# EAGLE schematic sterownik (EAGLE 8.4.0)
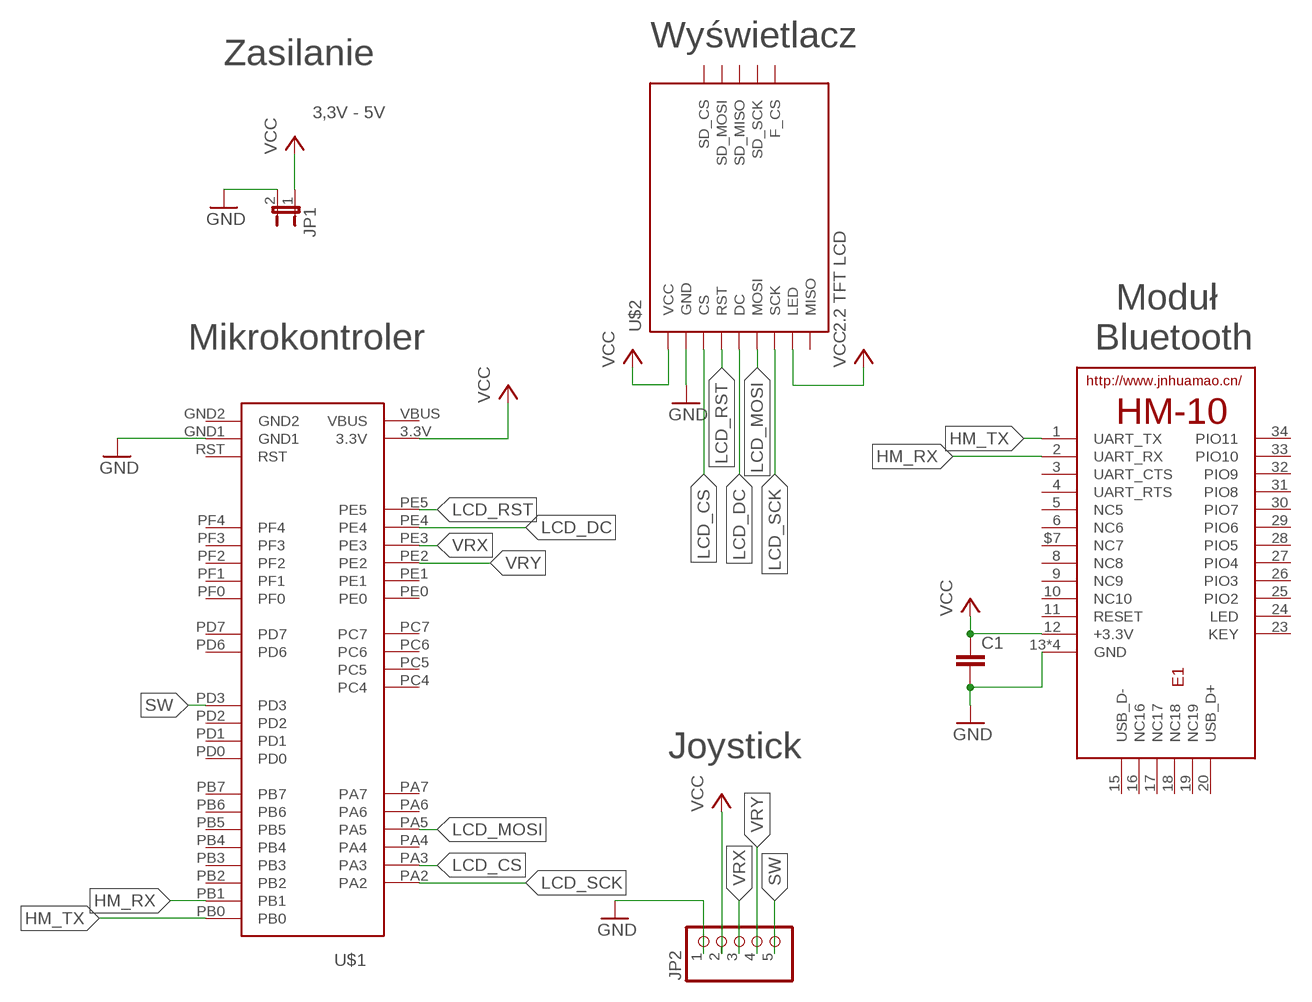
[diagram p0: schematic, sheet 1]

## Parts
C1  C-EU025-024X044  [C025-024X044]
E1  HM-10-BOARD  [26.9X13X2.2_BOARD]
JP1  JP1E  [JP1]
JP2  PINHD-1X55X2MM  [1_05X2MM]
U$1  STELLARIS-LAUNCHPADSTELLARIS-LAUNCHPAD  [LAUNCHPAD-XL]
U$2  2.2_TFT_LCD  [2.2_TFT_LCD]

## Nets
GND: C1.2 E1.13(GND) E1.14(GND) E1.21(GND) E1.22(GND) JP1.2 JP2.1 U$1.GND1 U$2.GND
HM_RX: E1.2(UART_RX) U$1.PB1
HM_TX: E1.1(UART_TX) U$1.PB0
LCD_CS: U$1.PA3 U$2.CS
LCD_DC: U$1.PE4 U$2.DC
LCD_MOSI: U$1.PA5 U$2.MOSI
LCD_RST: U$1.PE5 U$2.RST
LCD_SCK: U$1.PA2 U$2.SCK
SW: JP2.5 U$1.PD3
VCC: C1.1 E1.12(+3.3V) JP1.1 JP2.2 U$1.3.3V U$2.LED U$2.VCC
VRX: JP2.3 U$1.PE3
VRY: JP2.4 U$1.PE2
Unconnected: E1.3(UART_CTS) E1.4(UART_RTS) E1.5(NC5) E1.6(NC6) E1.8(NC8) E1.9(NC9) E1.10(NC10) E1.11(RESET) E1.15(USB_D-) E1.16(NC16) E1.17(NC17) E1.18(NC18) E1.19(NC19) E1.20(USB_D+) E1.23(KEY) E1.24(LED) E1.25(PIO2) E1.26(PIO3) E1.27(PIO4) E1.28(PIO5) E1.29(PIO6) E1.30(PIO7) E1.31(PIO8) E1.32(PIO9) E1.33(PIO10) E1.34(PIO11) E1.$7(NC7) U$1.PA4 U$1.PA6 U$1.PA7 U$1.PB2 U$1.PB3 U$1.PB4 U$1.PB5 U$1.PB6 U$1.PB7 U$1.PC4 U$1.PC5 U$1.PC6 U$1.PC7 U$1.PD0 U$1.PD1 U$1.PD2 U$1.PD6 U$1.PD7 U$1.PE0 U$1.PE1 U$1.PF0 U$1.PF1 U$1.PF2 U$1.PF3 U$1.PF4 U$2.F_CS U$2.MISO U$2.SD_CS U$2.SD_MISO U$2.SD_MOSI U$2.SD_SCK

## Notes on the sheet
- Wyświetlacz
- Zasilanie
- 3,3V - 5V
- Mikrokontroler
- Moduł 
  Bluetooth
- Joystick

## Power pins joined to a net without a drawn wire
GND2: U$1.GND2
RST: U$1.RST
VBUS: U$1.VBUS

## Library data of the parts
C1 = rcl:C-EU: CAPACITOR, European symbol
E1 = JNHuaMao:HM-10: HM Bluetooth module use TI CC2540 or CC2541, Master and slave roles in one, transmission version and remote control version and PIO state acquisition functions in one, Support the AT command modify module parameters, Convenient and flexible.
JP1 = jumper:JP1E: JUMPER
JP2 = pinhead:PINHD-1X5: PIN HEADER
U$1 = fabhack:STELLARIS-LAUNCHPAD: Stellaris Launchpad LM4F120 using all header pins to connect to XL booster packs.
U$2 = Aldar:2.2_TFT_LCD